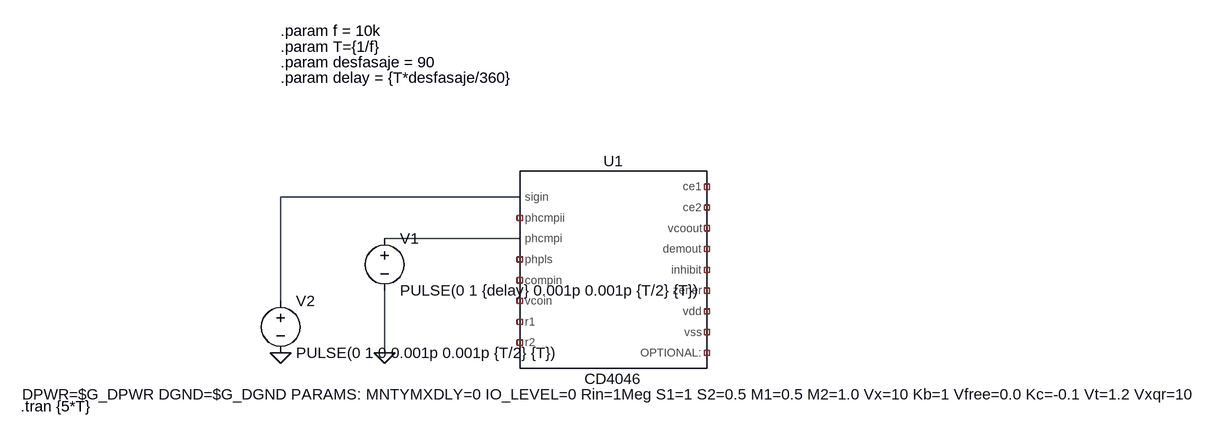
[diagram p0: schematic pll.asc]
pll.asc, the LTspice schematic file:
Version 4
SHEET 1 1144 680
WIRE 16 48 -352 48
WIRE 16 112 -192 112
WIRE -352 208 -352 48
WIRE -192 288 -192 192
FLAG -192 288 0
FLAG -352 288 0
SYMBOL CD4046 160 160 R0
SYMATTR InstName U1
SYMBOL voltage -192 96 R0
SYMATTR InstName V1
SYMATTR Value PULSE(0 1 {delay} 0.001p 0.001p {T/2} {T})
SYMBOL voltage -352 192 R0
WINDOW 123 0 0 Left 2
WINDOW 39 0 0 Left 2
SYMATTR InstName V2
SYMATTR Value PULSE(0 1 0 0.001p 0.001p {T/2} {T})
TEXT -352 -208 Left 2 !.param f = 10k
TEXT -352 -184 Left 2 !.param T={1/f}
TEXT -352 -160 Left 2 !.param desfasaje = 90
TEXT -352 -136 Left 2 !.param delay = {T*desfasaje/360}
TEXT -752 370 Left 2 !.tran {5*T}

The netlist it stands for:
* pll.asc
XU1 N001 NC_01 N002 NC_02 NC_03 NC_04 NC_05 NC_06 NC_07 NC_08 NC_09 NC_10 NC_11 NC_12 NC_13 NC_14 NC_15 CD4046 DPWR=$G_DPWR DGND=$G_DGND PARAMS: MNTYMXDLY=0 IO_LEVEL=0 Rin=1Meg S1=1 S2=0.5 M1=0.5 M2=1.0 Vx=10 Kb=1 Vfree=0.0 Kc=-0.1 Vt=1.2 Vxqr=10  ; pins sigin phcmpii phcmpi phpls compin vcoin r1 r2 ce1 ce2 vcoout demout inhibit zener vdd vss OPTIONAL:
V1 N002 0 PULSE(0 1 {delay} 0.001p 0.001p {T/2} {T})
V2 N001 0 PULSE(0 1 0 0.001p 0.001p {T/2} {T})
.param f = 10k
.param T={1/f}
.param desfasaje = 90
.param delay = {T*desfasaje/360}
.tran {5*T}
.lib C:\Users\mlste\Documents\ITBA\6 Cuatrimestre\TC\TC_TP6\Ej2\Simulacion\CD4046.mod
.backanno
.end